# EAGLE design 1455c_backplane_single (EAGLE 7.4.0)
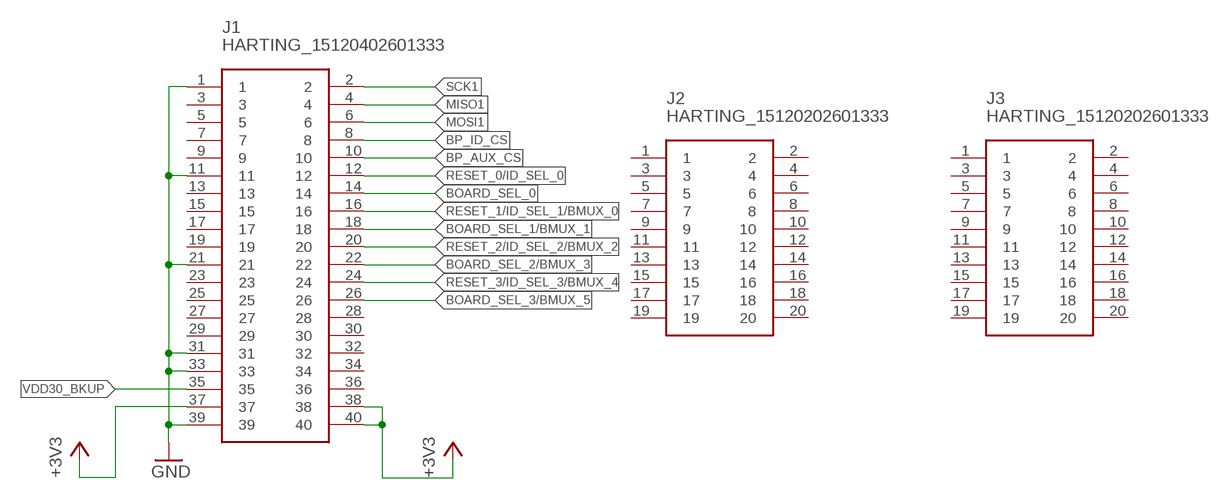
[diagram p0: schematic, sheet 1]

## Parts
J1  HARTING_15120402601333  [HARTING_15120402601333]
J2  HARTING_15120202601333  [HARTING_15120202601333]
J3  HARTING_15120202601333  [HARTING_15120202601333]

## Nets
+3V3: J1.37 J1.38 J1.40
BOARD_SEL_0: J1.14
BOARD_SEL_1/BMUX_1: J1.18
BOARD_SEL_2/BMUX_3: J1.22
BOARD_SEL_3/BMUX_5: J1.26
BP_AUX_CS: J1.10
BP_ID_CS: J1.8
GND: J1.1 J1.11 J1.21 J1.31 J1.33 J1.39
MISO1: J1.4
MOSI1: J1.6
RESET_0/ID_SEL_0: J1.12
RESET_1/ID_SEL_1/BMUX_0: J1.16
RESET_2/ID_SEL_2/BMUX_2: J1.20
RESET_3/ID_SEL_3/BMUX_4: J1.24
SCK1: J1.2
VDD30_BKUP: J1.35
Unconnected: J1.3 J1.5 J1.7 J1.9 J1.13 J1.15 J1.17 J1.19 J1.23 J1.25 J1.27 J1.28 J1.29 J1.30 J1.32 J1.34 J1.36 J2.1 J2.2 J2.3 J2.4 J2.5 J2.6 J2.7 J2.8 J2.9 J2.10 J2.11 J2.12 J2.13 J2.14 J2.15 J2.16 J2.17 J2.18 J2.19 J2.20 J3.1 J3.2 J3.3 J3.4 J3.5 J3.6 J3.7 J3.8 J3.9 J3.10 J3.11 J3.12 J3.13 J3.14 J3.15 J3.16 J3.17 J3.18 J3.19 J3.20

## Library data of the parts
J1 = harting-flex:HARTING_15120402601333
J2 J3 = harting-flex:HARTING_15120202601333

## Board
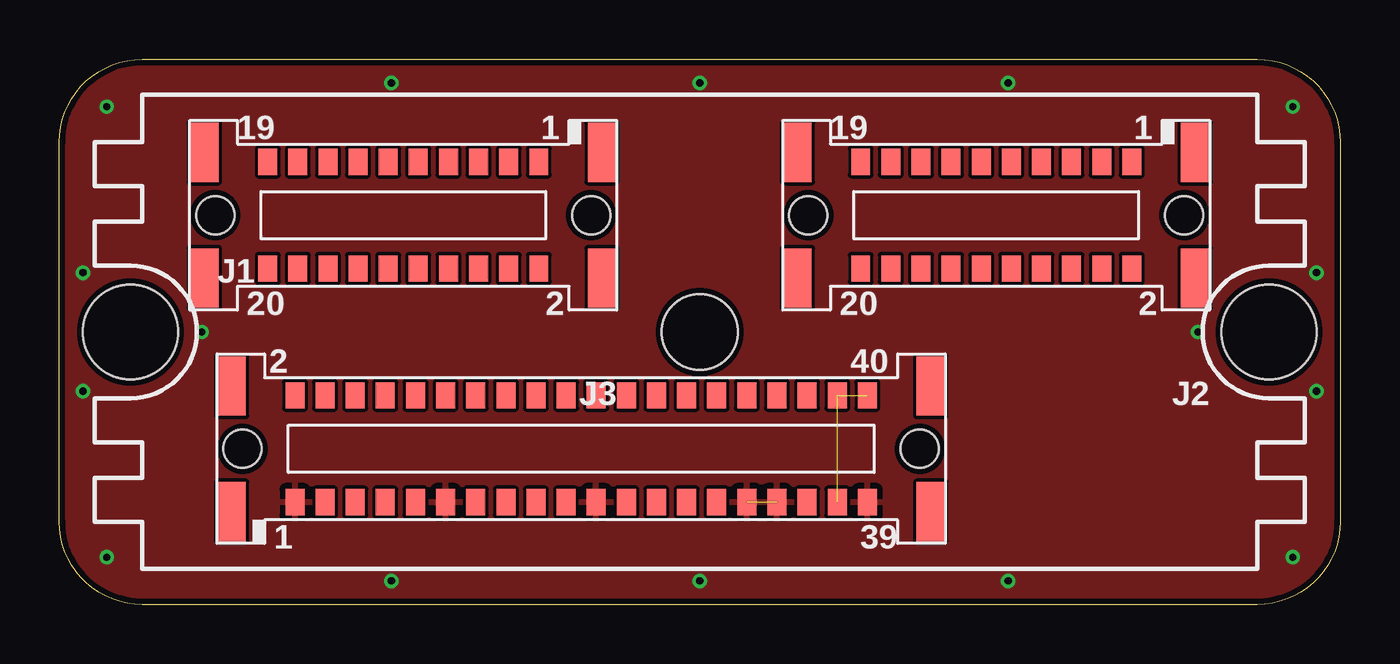
[diagram p1: board, top side]
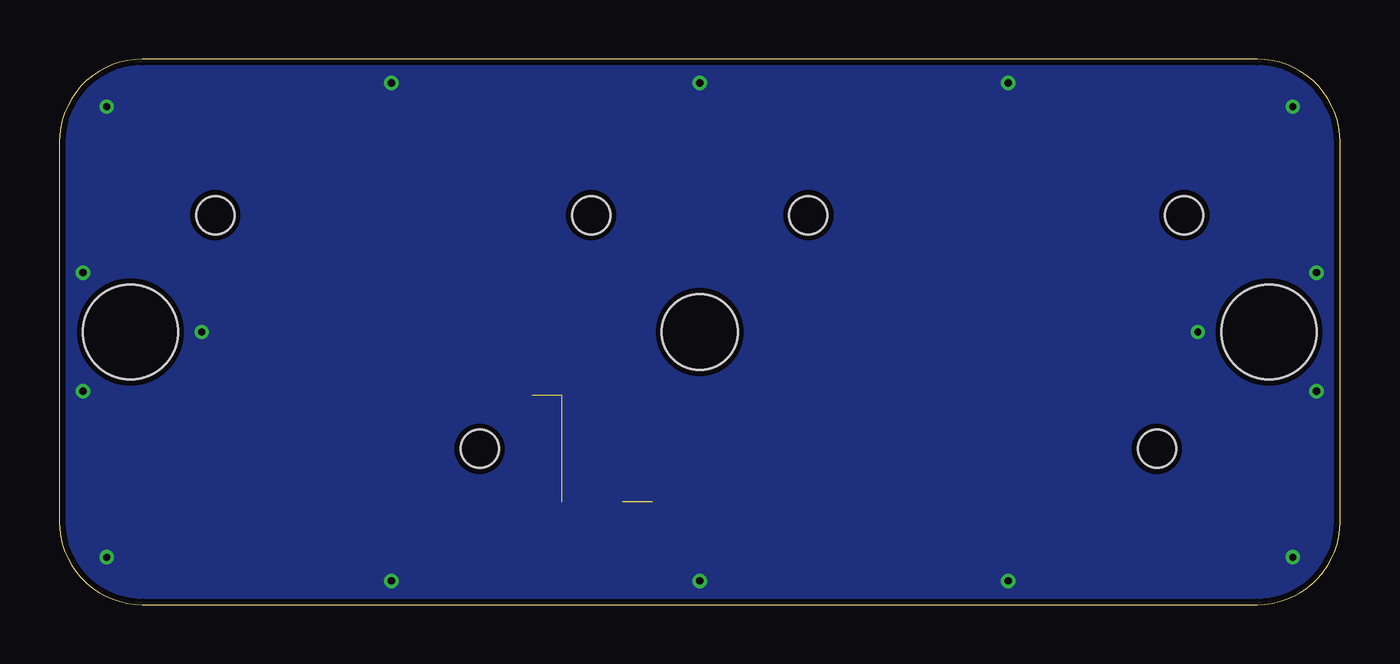
[diagram p2: board, bottom side, seen from below]

Size 54 x 23 mm. Coordinates in mm from the lower left corner, seen from the top.
Outline: 3.5,23 50.5,23 arc-90 54,19.5 54,3.5 arc-90 50.5,0 3.5,0 arc-90 0,3.5 0,19.5 arc-90 3.5,23
Copper layers (1*16): Top 0.035mm / dielectric 1.5mm / Bottom 0.035mm
Design rules "seeed": minimum track width 6mil, minimum drill 0.3mm, track to track 6mil, track to pad 6mil, pad to pad 6mil, via to via 6mil, smd to smd 0mil, copper to edge 10mil, drill to drill 10mil, minimum pad ring 6mil, minimum via ring 6mil, stop-mask expansion 2mil, vias tented up to drill 0.5mm, thermal gap 10mil
Holes 4 mm at 3,11.5 51,11.5
Holes 3.2 mm at 27,11.5
tKeepout: 11 lines
bKeepout: area 22,6.5 to 32,16.5

### Footprints (pad centres in the part's own frame; a part is rotated, then mirrored left to right if it is on the bottom)
HARTING_15120402601333 = smd 0.8 x 1.1: 1 -12.065,-2.25; 2 -12.065,2.25; 3 -10.795,-2.25; 4 -10.795,2.25; 5 -9.525,-2.25; 6 -9.525,2.25; 7 -8.255,-2.25; 8 -8.255,2.25; 9 -6.985,-2.25; 10 -6.985,2.25; 11 -5.715,-2.25; 12 -5.715,2.25; 13 -4.445,-2.25; 14 -4.445,2.25; 15 -3.175,-2.25; 16 -3.175,2.25; 17 -1.905,-2.25; 18 -1.905,2.25; 19 -0.635,-2.25; 20 -0.635,2.25; 21 0.635,-2.25; 22 0.635,2.25; 23 1.905,-2.25; 24 1.905,2.25; 25 3.175,-2.25; 26 3.175,2.25; 27 4.445,-2.25; 28 4.445,2.25; 29 5.715,-2.25; 30 5.715,2.25; 31 6.985,-2.25; 32 6.985,2.25; 33 8.255,-2.25; 34 8.255,2.25; 35 9.525,-2.25; 36 9.525,2.25; 37 10.795,-2.25; 38 10.795,2.25; 39 12.065,-2.25; 40 12.065,2.25 | smd 1.2 x 2.5: P1 -14.74,-2.65; P2 -14.74,2.65; P3 14.74,-2.65; P4 14.74,2.65 | hole 1.6: -14.275,0; 14.275,0
HARTING_15120202601333 = smd 0.8 x 1.1: 1 -5.715,-2.25; 2 -5.715,2.25; 3 -4.445,-2.25; 4 -4.445,2.25; 5 -3.175,-2.25; 6 -3.175,2.25; 7 -1.905,-2.25; 8 -1.905,2.25; 9 -0.635,-2.25; 10 -0.635,2.25; 11 0.635,-2.25; 12 0.635,2.25; 13 1.905,-2.25; 14 1.905,2.25; 15 3.175,-2.25; 16 3.175,2.25; 17 4.445,-2.25; 18 4.445,2.25; 19 5.715,-2.25; 20 5.715,2.25 | smd 1.2 x 2.5: P1 -8.39,-2.65; P2 -8.39,2.65; P3 8.39,-2.65; P4 8.39,2.65 | hole 1.6: -7.925,0; 7.925,0

### Placement (x,y rotation side)
J1  22,6.58 0 top
J2  39.5,16.43 180 top
J3  14.5,16.43 180 top

### Tracks (layer width: path | path; a pad name or v marks a point on that pad's centre or on a via)
+3V3  (2 unrouted)
GND  (via drill 0.3)  (1 unrouted)
  other vias: 2,2 2,21 52,21 52,2 27,1 27,22 14,22 14,1 40,1 40,22 1,9 1,14 53,14 53,9 6,11.5 48,11.5
  pour Bottom: 3.5,23 50.5,23 arc-90 54,19.5 54,3.5 arc-90 50.5,0 3.5,0 arc-90 0,3.5 0,19.5 arc-90
  pour Top: 3.5,23 50.5,23 arc-90 54,19.5 54,3.5 arc-90 50.5,0 3.5,0 arc-90 0,3.5 0,19.5 arc-90